# Altium schematic sheet er9x.SchDoc
size A1
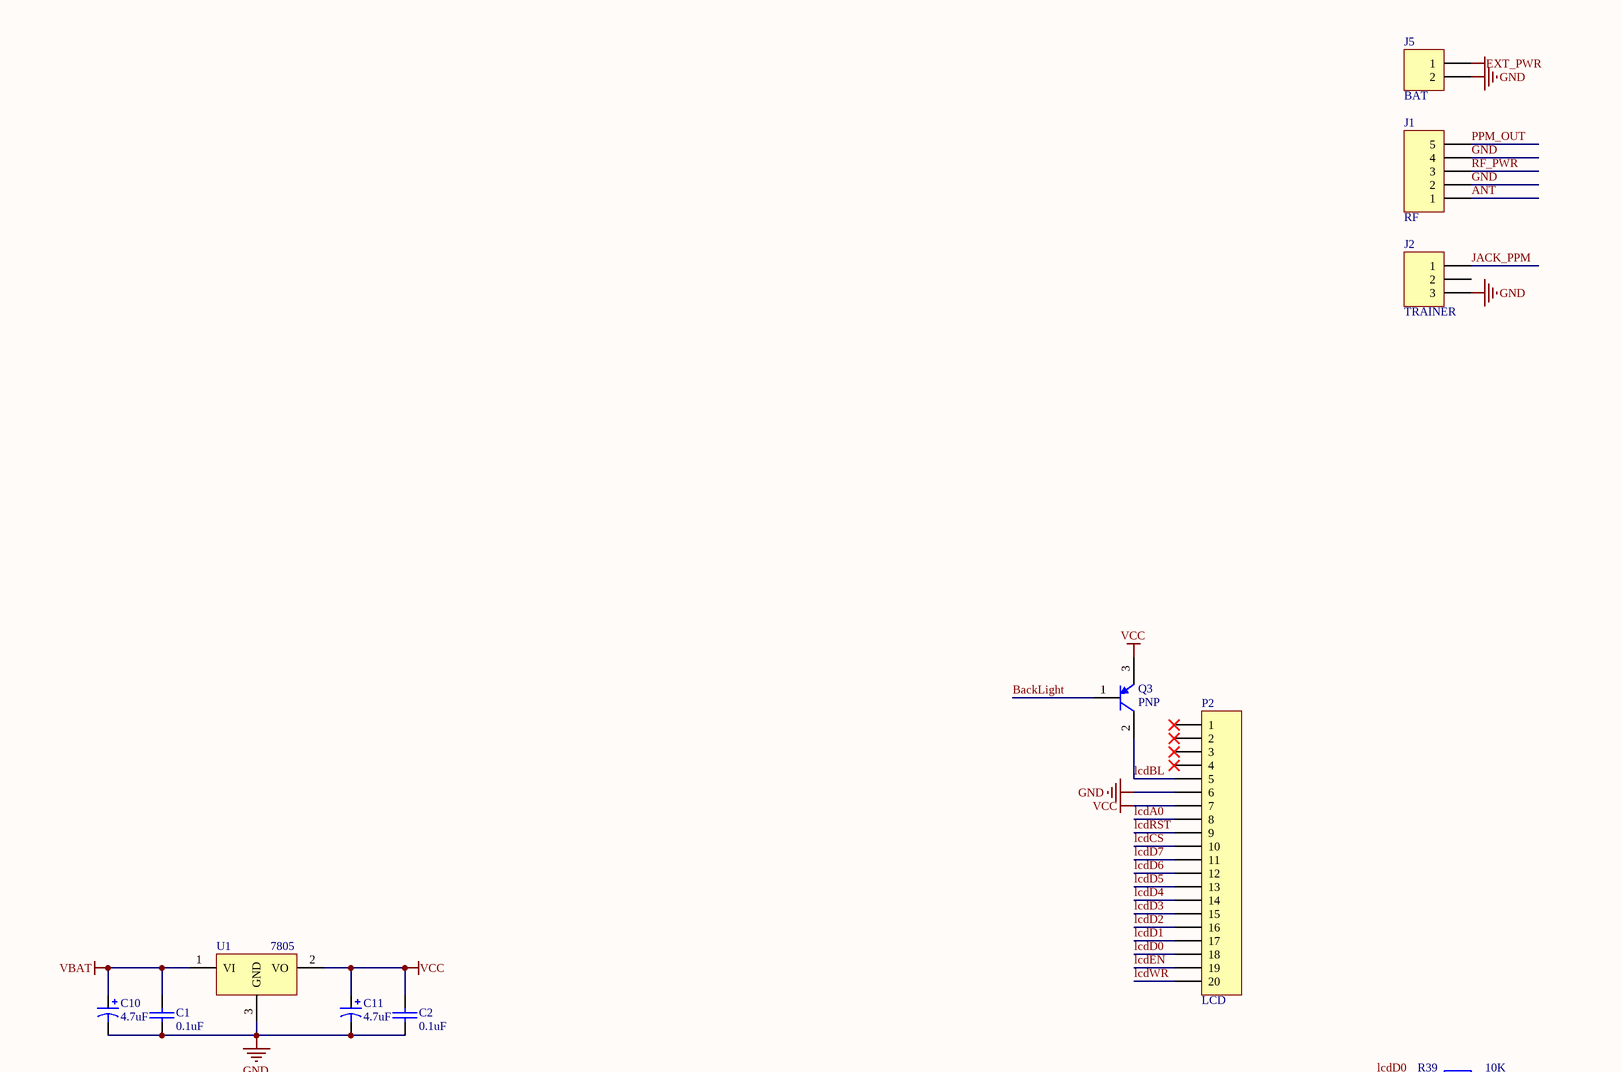
[diagram p0: er9x.SchDoc, top left]
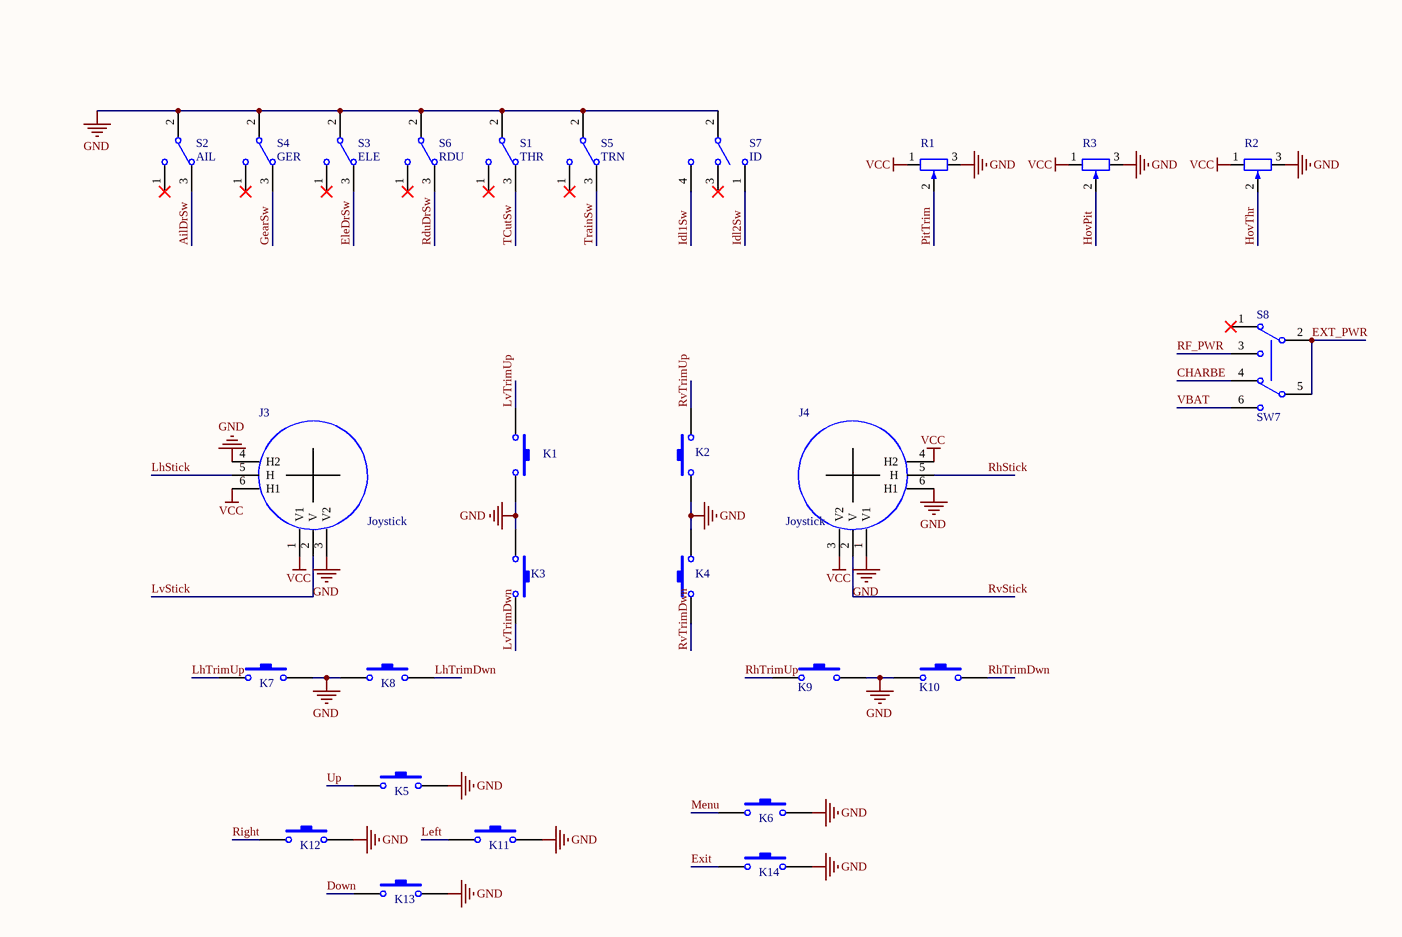
[diagram p1: er9x.SchDoc, top right]
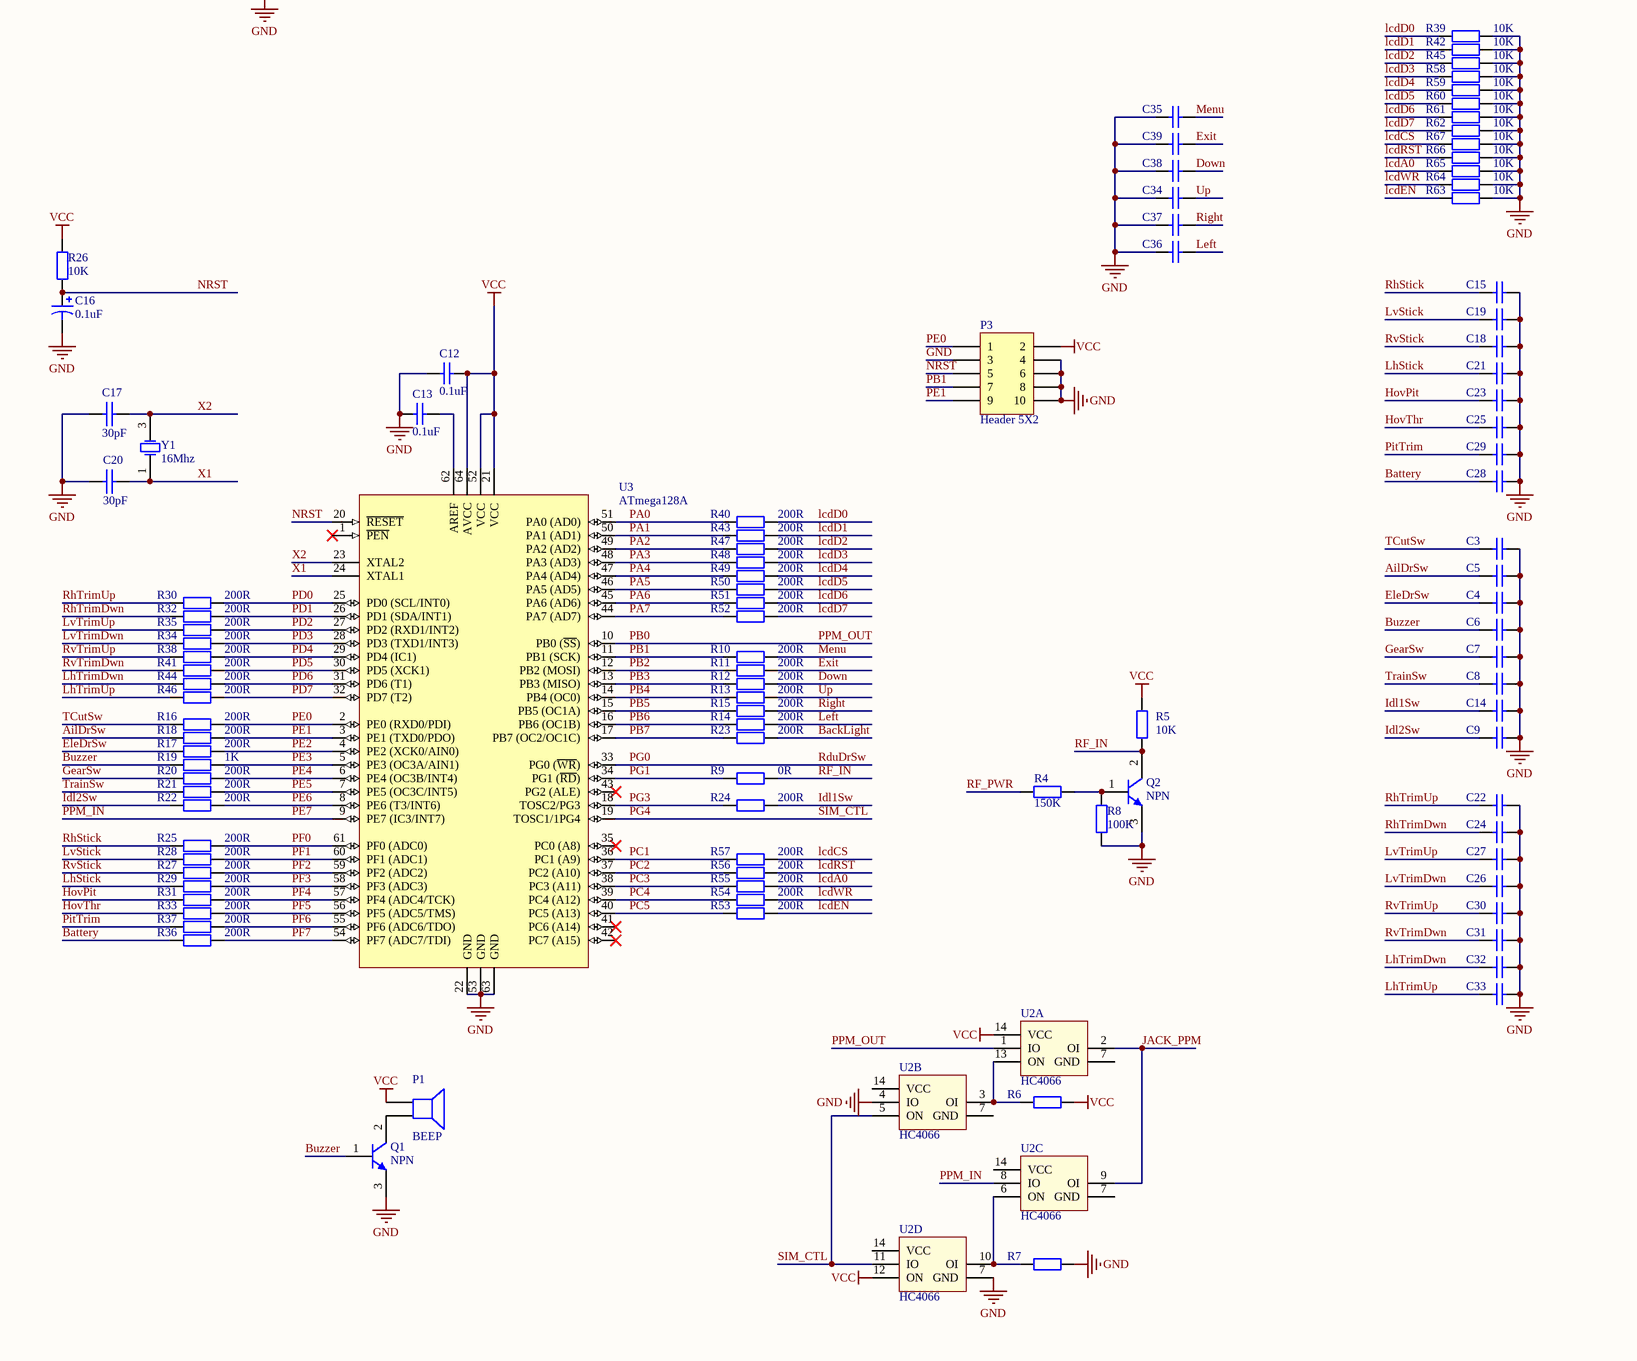
[diagram p2: er9x.SchDoc, bottom left]

## Parts
C1  0.1uF  [0603C]
C2  0.1uF  [0603C]
C3  2.2uF  [0603C]  (value not drawn)
C4  2.2uF  [0603C]  (value not drawn)
C5  2.2uF  [0603C]  (value not drawn)
C6  2.2uF  [0603C]  (value not drawn)
C7  2.2uF  [0603C]  (value not drawn)
C8  2.2uF  [0603C]  (value not drawn)
C9  2.2uF  [0603C]  (value not drawn)
C10  4.7uF  [B]
C11  4.7uF  [B]
C12  0.1uF  [0603C]
C13  0.1uF  [0603C]
C14  2.2uF  [0603C]  (value not drawn)
C15  2.2uF  [0603C]  (value not drawn)
C16  0.1uF  [0603C]
C17  30pF  [0603C]
C18  2.2uF  [0603C]  (value not drawn)
C19  2.2uF  [0603C]  (value not drawn)
C20  30pF  [0603C]
C21  2.2uF  [0603C]  (value not drawn)
C22  2.2uF  [0603C]  (value not drawn)
C23  2.2uF  [0603C]  (value not drawn)
C24  2.2uF  [0603C]  (value not drawn)
C25  2.2uF  [0603C]  (value not drawn)
C26  2.2uF  [0603C]  (value not drawn)
C27  2.2uF  [0603C]  (value not drawn)
C28  2.2uF  [0603C]  (value not drawn)
C29  2.2uF  [0603C]  (value not drawn)
C30  2.2uF  [0603C]  (value not drawn)
C31  2.2uF  [0603C]  (value not drawn)
C32  2.2uF  [0603C]  (value not drawn)
C33  2.2uF  [0603C]  (value not drawn)
C34  2.2uF  [0603C]  (value not drawn)
C35  2.2uF  [0603C]  (value not drawn)
C36  2.2uF  [0603C]  (value not drawn)
C37  2.2uF  [0603C]  (value not drawn)
C38  2.2uF  [0603C]  (value not drawn)
C39  2.2uF  [0603C]  (value not drawn)
J1  RF  [HDR1X5]
J2  TRAINER  [PJ-393]
J3  Joystick  [BIG]
J4  Joystick  [BIG]
J5  BAT  [HDR1X2]
K1  SW-PB  [KEY]  (value not drawn)
K2  SW-PB  [KEY]  (value not drawn)
K3  SW-PB  [KEY]  (value not drawn)
K4  SW-PB  [KEY]  (value not drawn)
K5  SW-PB  [KEY]  (value not drawn)
K6  SW-PB  [KEY]  (value not drawn)
K7  SW-PB  [KEY]  (value not drawn)
K8  SW-PB  [KEY]  (value not drawn)
K9  SW-PB  [KEY]  (value not drawn)
K10  SW-PB  [KEY]  (value not drawn)
K11  SW-PB  [KEY]  (value not drawn)
K12  SW-PB  [KEY]  (value not drawn)
K13  SW-PB  [KEY]  (value not drawn)
K14  SW-PB  [KEY]  (value not drawn)
P1  BEEP  [BEEP]
P2  LCD  [FPC]
P3  Header 5X2  [HDR2X5]
Q1  NPN  [SOT-23]
Q2  NPN  [SOT-23]
Q3  PNP  [SOT-23]
R1  RPot SM  [3296]  (value not drawn)
R2  RPot SM  [3296]  (value not drawn)
R3  RPot SM  [3296]  (value not drawn)
R4  150K  [0603R]
R5  10K  [0603R]
R6  200R  [0603R]  (value not drawn)
R7  200R  [0603R]  (value not drawn)
R8  100K  [0603R]
R9  0R  [0603R]
R10  200R  [0603R]
R11  200R  [0603R]
R12  200R  [0603R]
R13  200R  [0603R]
R14  200R  [0603R]
R15  200R  [0603R]
R16  200R  [0603R]
R17  200R  [0603R]
R18  200R  [0603R]
R19  1K  [0603R]
R20  200R  [0603R]
R21  200R  [0603R]
R22  200R  [0603R]
R23  200R  [0603R]
R24  200R  [0603R]
R25  200R  [0603R]
R26  10K  [0603R]
R27  200R  [0603R]
R28  200R  [0603R]
R29  200R  [0603R]
R30  200R  [0603R]
R31  200R  [0603R]
R32  200R  [0603R]
R33  200R  [0603R]
R34  200R  [0603R]
R35  200R  [0603R]
R36  200R  [0603R]
R37  200R  [0603R]
R38  200R  [0603R]
R39  10K  [0603R]
R40  200R  [0603R]
R41  200R  [0603R]
R42  10K  [0603R]
R43  200R  [0603R]
R44  200R  [0603R]
R45  10K  [0603R]
R46  200R  [0603R]
R47  200R  [0603R]
R48  200R  [0603R]
R49  200R  [0603R]
R50  200R  [0603R]
R51  200R  [0603R]
R52  200R  [0603R]
R53  200R  [0603R]
R54  200R  [0603R]
R55  200R  [0603R]
R56  200R  [0603R]
R57  200R  [0603R]
R58  10K  [0603R]
R59  10K  [0603R]
R60  10K  [0603R]
R61  10K  [0603R]
R62  10K  [0603R]
R63  10K  [0603R]
R64  10K  [0603R]
R65  10K  [0603R]
R66  10K  [0603R]
R67  10K  [0603R]
S1  THR  [2235D]
S2  AIL  [2235D]
S3  ELE  [2235D]
S4  GER  [2235D]
S5  TRN  [2235D]
S6  RDU  [2235D]
S7  ID  [2336D]
S8  SW7  [LOCK]
U1  7805  [TO-263]
U2  HC4066  [TSSOP-14]  (parts A,B,C,D of 4)
U3  ATmega128A  [LQFP-64]
Y1  16Mhz  [3225]

## Nets
EXT_PWR: J5.1 S8.2 S8.5
GND: C1.2 C2.2 C3.2 C4.2 C5.2 C6.2 C7.2 C8.2 C9.2 C10.2 C11.2 C12.2 C13.2 C14.2 C15.2 C16.2 C17.1 C18.2 C19.2 C20.2 C21.2 C22.2 C23.2 C24.2 C25.2 C26.2 C27.2 C28.2 C29.2 C30.2 C31.2 C32.2 C33.2 C34.1 C35.1 C36.1 C37.1 C38.1 C39.1 J1.2 J1.4 J2.3 J3.3(V2) J3.4(H2) J4.1(V1) J4.6(H1) J5.2 K1.2 K2.2 K3.1 K4.1 K5.2 K6.2 K7.2 K8.1 K9.1 K10.2 K11.2 K12.2 K13.2 K14.2 P2.6 P3.3 P3.4 P3.6 P3.8 P3.10 Q1.3(E) Q2.3(E) R1.3(+) R2.3(+) R3.3(+) R7.1 R8.1 R39.1 R42.1 R45.1 R58.1 R59.1 R60.1 R61.1 R62.1 R63.1 R64.1 R65.1 R66.1 R67.1 S1.2 S2.2 S3.2 S4.2 S5.2 S6.2 S7.2(NC1) U1.3(GND) U2.4(IO) U2.7(GND) U3.22(GND) U3.53(GND) U3.63(GND)
VBAT: C1.1 C10.1 S8.6 U1.1(VI)
VCC: C2.1 C11.1 C12.1 J3.1(V1) J3.6(H1) J4.3(V2) J4.4(H2) P1.1 P2.7 P3.2 Q3.3(E) R1.1(-) R2.1(-) R3.1(-) R5.1 R6.1 R26.2 U1.2(VO) U2.12(ON) U2.14(VCC) U3.21(VCC) U3.52(VCC) U3.64(AVCC)
AilDrSw: C5.1 R18.2 S2.3
ANT: J1.1
BackLight: Q3.1(B) R23.1
Battery: C28.1 R36.2
Buzzer: C6.1 Q1.1(B) R19.2
CHARBE: S8.4
Down: C38.2 K13.1 R12.1
EleDrSw: C4.1 R17.2 S3.3
Exit: C39.2 K14.1 R11.1
GearSw: C7.1 R20.2 S4.3
HovPit: C23.1 R3.2(W) R31.2
HovThr: C25.1 R2.2(W) R33.2
Idl1Sw: C14.1 R24.1 S7.4(NC2)
Idl2Sw: C9.1 R22.2 S7.1(COMMON1)
JACK_PPM: J2.1 U2.2(OI) U2.9(OI)
lcdA0: P2.8 R55.1 R65.2
lcdBL: P2.5 Q3.2(C)
lcdCS: P2.10 R57.1 R67.2
lcdD0: P2.18 R39.2 R40.1
lcdD1: P2.17 R42.2 R43.1
lcdD2: P2.16 R45.2 R47.1
lcdD3: P2.15 R48.1 R58.2
lcdD4: P2.14 R49.1 R59.2
lcdD5: P2.13 R50.1 R60.2
lcdD6: P2.12 R51.1 R61.2
lcdD7: P2.11 R52.1 R62.2
lcdEN: P2.19 R53.1 R63.2
lcdRST: P2.9 R56.1 R66.2
lcdWR: P2.20 R54.1 R64.2
Left: C36.2 K11.1 R14.1
LhStick: C21.1 J3.5(H) R29.2
LhTrimDwn: C32.1 K8.2 R44.2
LhTrimUp: C33.1 K7.1 R46.2
LvStick: C19.1 J3.2(V) R28.2
LvTrimDwn: C26.1 K3.2 R34.2
LvTrimUp: C27.1 K1.1 R35.2
Menu: C35.2 K6.1 R10.1
NRST: C16.1 P3.5 R26.1 U3.20(~{RESET})
PA0: R40.2 U3.51(PA0_(AD0))
PA1: R43.2 U3.50(PA1_(AD1))
PA2: R47.2 U3.49(PA2_(AD2))
PA3: R48.2 U3.48(PA3_(AD3))
PA4: R49.2 U3.47(PA4_(AD4))
PA5: R50.2 U3.46(PA5_(AD5))
PA6: R51.2 U3.45(PA6_(AD6))
PA7: R52.2 U3.44(PA7_(AD7))
PB0: J1.5 U2.1(IO) U3.10(PB0_(~{SS}))  [also labelled PPM_OUT]
PB1: P3.7 R10.2 U3.11(PB1_(SCK))
PB2: R11.2 U3.12(PB2_(MOSI))
PB3: R12.2 U3.13(PB3_(MISO))
PB4: R13.2 U3.14(PB4_(OC0))
PB5: R15.2 U3.15(PB5_(OC1A))
PB6: R14.2 U3.16(PB6_(OC1B))
PB7: R23.2 U3.17(PB7_(OC2/OC1C))
PC1: R57.2 U3.36(PC1_(A9))
PC2: R56.2 U3.37(PC2_(A10))
PC3: R55.2 U3.38(PC3_(A11))
PC4: R54.2 U3.39(PC4_(A12))
PC5: R53.2 U3.40(PC5_(A13))
PD0: R30.1 U3.25(PD0_(SCL/INT0))
PD1: R32.1 U3.26(PD1_(SDA/INT1))
PD2: R35.1 U3.27(PD2_(RXD1/INT2))
PD3: R34.1 U3.28(PD3_(TXD1/INT3))
PD4: R38.1 U3.29(PD4_(IC1))
PD5: R41.1 U3.30(PD5_(XCK1))
PD6: R44.1 U3.31(PD6_(T1))
PD7: R46.1 U3.32(PD7_(T2))
PE0: P3.1 R16.1 U3.2(PE0_(RXD0/PDI))
PE1: P3.9 R18.1 U3.3(PE1_(TXD0/PDO))
PE2: R17.1 U3.4(PE2_(XCK0/AIN0))
PE3: R19.1 U3.5(PE3_(OC3A/AIN1))
PE4: R20.1 U3.6(PE4_(OC3B/INT4))
PE5: R21.1 U3.7(PE5_(OC3C/INT5))
PE6: R22.1 U3.8(PE6_(T3/INT6))
PE7: U2.8(IO) U3.9(PE7_(IC3/INT7))  [also labelled PPM_IN]
PF0: R25.1 U3.61(PF0_(ADC0))
PF1: R28.1 U3.60(PF1_(ADC1))
PF2: R27.1 U3.59(PF2_(ADC2))
PF3: R29.1 U3.58(PF3_(ADC3))
PF4: R31.1 U3.57(PF4_(ADC4/TCK))
PF5: R33.1 U3.56(PF5_(ADC5/TMS))
PF6: R37.1 U3.55(PF6_(ADC6/TDO))
PF7: R36.1 U3.54(PF7_(ADC7/TDI))
PG0: S6.3 U3.33(PG0_(~{WR}))  [also labelled RduDrSw]
PG1: R9.2 U3.34(PG1_(~{RD}))
PG3: R24.2 U3.18(TOSC2/PG3)
PG4: U2.5(ON) U2.11(IO) U3.19(TOSC1/1PG4)  [also labelled SIM_CTL]
PitTrim: C29.1 R1.2(W) R37.2
RF_IN: Q2.2(C) R5.2 R9.1
RF_PWR: J1.3 R4.2 S8.3
RhStick: C15.1 J4.5(H) R25.2
RhTrimDwn: C24.1 K10.1 R32.2
RhTrimUp: C22.1 K9.2 R30.2
Right: C37.2 K12.1 R15.1
RvStick: C18.1 J4.2(V) R27.2
RvTrimDwn: C31.1 K4.2 R41.2
RvTrimUp: C30.1 K2.1 R38.2
TCutSw: C3.1 R16.2 S1.3
TrainSw: C8.1 R21.2 S5.3
Up: C34.2 K5.1 R13.1
X1: C20.1 U3.24(XTAL1) Y1.1(OSC1)
X2: C17.2 U3.23(XTAL2) Y1.3(OSC2)
NetC13_1: C13.1 U3.62(AREF)
NetP1_2: P1.2 Q1.2(C)
NetQ2_1: Q2.1(B) R4.1 R8.2
NetR6_2: R6.2 U2.3(OI) U2.13(ON)
NetR7_2: R7.2 U2.6(ON) U2.10(OI)

Not connected (* = marked no-connect by the designer): J2 2; P2 1* 2* 3* 4*; S1 1*; S2 1*; S3 1*; S4 1*; S5 1*; S6 1*; S7 3(NO1)*; S8 1(3)*; U3 1(~{PEN})* 35(PC0_(A8))* 41(PC6_(A14))* 42(PC7_(A15))* 43(PG2_(ALE))*

## Library data of the parts
C1 C2 C17 C20 = CAP: Capacitor
C3-C9 C14 C15 C18 C19 C21-C39 = Cap: Capacitor; Value: 100pF; Published: 8-Jun-2000; LatestRevisionDate: 17-Jul-2002; LatestRevisionNote: Re-released for DXP Platform.; PackageReference: RAD-0.3; Publisher: Altium Limited
C10 C11 C16 = Cap Pol1: Polarized Capacitor (Radial); Value: 100pF; Published: 8-Jun-2000; LatestRevisionDate: 17-Jul-2002; LatestRevisionNote: Re-released for DXP Platform.; PackageReference: RB7.6-15; Publisher: Altium Limited
C12 C13 = Cap: Capacitor; Value: 10nF; Published: 8-Jun-2000; Revision: July-2002: Re-released for DXP Platform.; Publisher: Altium Limited
J1 = Header 5: Header, 5-Pin; LatestRevisionDate: 17-Jul-2002; LatestRevisionNote: Re-released for DXP Platform.; Publisher: Altium Limited
J2 = Header 3: Header, 3-Pin; LatestRevisionDate: 17-Jul-2002; LatestRevisionNote: Re-released for DXP Platform.; Publisher: Altium Limited
J3 J4 = RPot SM_1: Square Trimming Potentiometer; Published: 17-Dec-2003; DatasheetVersion: Oct-2003; PackageReference: POT4MM-2; Publisher: Altium Limited; ComponentLink1Description: Manufacturer Link; ComponentLink1URL: http://bourns.com/2/search.html
J5 = Header 2: Header, 2-Pin; LatestRevisionDate: 17-Jul-2002; LatestRevisionNote: Re-released for DXP Platform.; Publisher: Altium Limited
K1-K14 = SW-PB: Switch; Published: 24-Mar-1999; LatestRevisionDate: 17-Jul-2002; LatestRevisionNote: Re-released for DXP Platform.; PackageReference: SPST-2; Publisher: Altium Limited
P1 = Speaker: Loudspeaker; Published: 24-Mar-1999; LatestRevisionDate: 17-Jul-2002; LatestRevisionNote: Re-released for DXP Platform.; PackageReference: PIN2; Publisher: Altium Limited
P2 = Header 20: Header, 20-Pin; LatestRevisionDate: 17-Jul-2002; LatestRevisionNote: Re-released for DXP Platform.; Publisher: Altium Limited
P3 = Header 5X2: Header, 5-Pin, Dual row; LatestRevisionDate: 17-Jul-2002; LatestRevisionNote: Re-released for DXP Platform.; Publisher: Altium Limited
Q1 Q2 = NPN: NPN Bipolar Transistor; Published: 8-Jun-2000; LatestRevisionDate: 17-Jul-2002; LatestRevisionNote: Re-released for DXP Platform.; PackageReference: TO-226; Publisher: Altium Limited; Code_JEDEC: TO-226-AA
Q3 = PNP: PNP Bipolar Transistor; Published: 8-Jun-2000; LatestRevisionDate: 29-May-2009; LatestRevisionNote: IPC-7351 Footprint Added.; PackageVersion: Aug-1999; PackageReference: SOT-23B; Publisher: Altium Limited; PackageDescription: 3-Pin SOT-23 Package 0.95 mm Pitch, 2.4 mm Lead Span
R1-R3 = RPot SM: Square Trimming Potentiometer; Published: 17-Dec-2003; DatasheetVersion: Oct-2003; PackageReference: POT4MM-2; Publisher: Altium Limited; ComponentLink1Description: Manufacturer Link; ComponentLink1URL: http://bourns.com/2/search.html
R4-R18 R20-R25 R27-R67 = Res2: Resistor; Value: 1K; Published: 8-Jun-2000; LatestRevisionDate: 17-Jul-2002; LatestRevisionNote: Re-released for DXP Platform.; PackageReference: AXIAL-0.4; Publisher: Altium Limited
R19 R26 = Res2: Resistor; Published: 8-Jun-2000; Publisher: Altium Limited
  R19: LatestRevisionDate: 17-Jul-2002; LatestRevisionNote: Re-released for DXP Platform.; PackageReference: AXIAL-0.4; Value: 1K
  R26: Revision: July-2002: Re-released for DXP Platform.; Value: 10K
S1-S6 S8 = SW-SPDT: SPDT Subminiature Toggle Switch, Right Angle Mounting, Vertical Actuation; Published: 24-Mar-1999; LatestRevisionDate: 17-Dec-2003; LatestRevisionNote: Schematic revised, PCB Footprint replaced.; DatasheetVersion: 05-Dec-2000; PackageReference: TL36WW15050; Publisher: Altium Limited; ComponentLink1Description: Manufacturer Link; ComponentLink1URL: http://www.apem.com
S7 = SW DPDT: Switch; Published: 24-Mar-1999; LatestRevisionDate: 29-May-2009; LatestRevisionNote: IPC-7351 Footprint Added.; PackageVersion: Mar-2001; PackageReference: SOT23-6; Publisher: Altium Limited; PackageDescription: 6-Pin SOT-23 Package 0.95 mm Pitch, 2.7 mm Lead Span; Code_JEITA: SC-74; Code_IPC: SOT26A-6
U1 = 7805: Header, 3-Pin, Dual row; LatestRevisionDate: 17-Jul-2002; LatestRevisionNote: Re-released for DXP Platform.; Publisher: Altium Limited
U3 = ATmega128L-8MC: 8-Bit AVR Microcontroller with 128K Bytes of In-System Programmable Flash Memory; Published: 26-May-2004; LatestRevisionDate: 13-Apr-2006; LatestRevisionNote: IPC-7351 Footprint Added.; DatasheetVersion: 2467G-AVR-09/02; PackageVersion: revB, Aug-2001; PackageReference: 64M1; Publisher: Altium Limited; PackageDescription: 64-Pin Quad Flat No-Lead 0.5 mm Pitch; Code_JEDEC: MO-220-VMMD; ComponentLink1Description: Manufacturer Link; ComponentLink1URL: http://www.atmel.com; ComponentLink2Description: Datasheet; ComponentLink2URL: http://www.atmel.com/dyn/resources/prod_documents/doc2467.pdf
Y1 = XTAL: Crystal Oscillator; Published: 8-Jun-2000; LatestRevisionDate: 17-Jul-2002; LatestRevisionNote: Re-released for DXP Platform.; PackageReference: R38; Publisher: Altium Limited
U2 = HC4066: LatestRevisionDate: 17-Jul-2002; LatestRevisionNote: Re-released for DXP Platform.; Publisher: Altium Limited